# EAGLE design ProMicro_Attniy85_Prog (EAGLE 9.6.2)
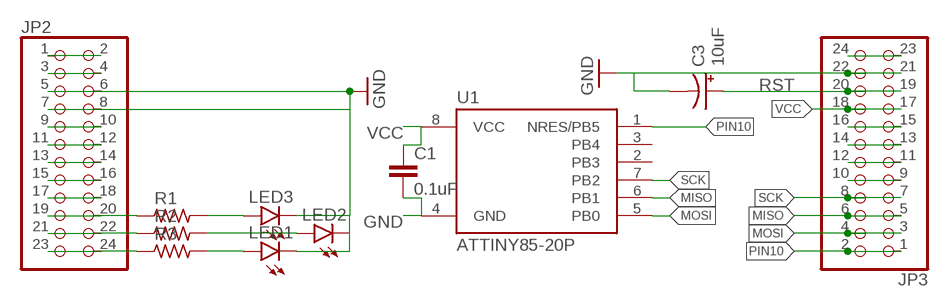
[diagram p0: schematic, sheet 1]

## Parts
C1  0.1uF  0.1UF-0603-100V-10%  [0603]
C3  10uF  10UF-POLAR-EIA3216-16V-10%(TANT)  [EIA3216]
JP2  PINHD-2X12  [2X12]
JP3  PINHD-2X12  [2X12]
LED1  LEDCHIP-LED0805  [CHIP-LED0805]
LED2  LEDCHIP-LED0805  [CHIP-LED0805]
LED3  LEDCHIP-LED0805  [CHIP-LED0805]
R1  R_0805  [R0805]
R2  R_0805  [R0805]
R3  R_0805  [R0805]
U1  ATTINY85-20P  [PDIP08_300MIL]

## Nets
GND [gnd]: C1.2 C3.- JP2.5 JP2.6 JP2.7 JP2.8 JP3.21 JP3.22 LED1.C LED2.C LED3.C U1.4(GND)
MISO: JP3.5 JP3.6 U1.6(PB1)
MOSI: JP3.3 JP3.4 U1.5(PB0)
N$1: JP2.1 JP2.2
N$2: JP2.3 JP2.4
N$3: JP2.9 JP2.10
N$4: JP2.11 JP2.12
N$5: JP2.13 JP2.14
N$6: JP2.15 JP2.16
N$7: JP2.17 JP2.18
N$8: LED3.A R1.2
N$9: LED2.A R2.2
N$10: LED1.A R3.2
N$11: JP3.9 JP3.10
N$12: JP3.11 JP3.12
N$13: JP3.13 JP3.14
N$14: JP3.15 JP3.16
N$15: JP3.23 JP3.24
PIN7: JP2.19 JP2.20 R1.1
PIN8: JP2.21 JP2.22 R2.1
PIN9: JP2.23 JP2.24 R3.1
PIN10: JP3.1 JP3.2 U1.1(NRES/PB5)
RST: C3.+ JP3.19 JP3.20
SCK: JP3.7 JP3.8 U1.7(PB2)
VCC [vcc]: C1.1 JP3.17 JP3.18 U1.8(VCC)
Unconnected: U1.2(PB3) U1.3(PB4)

## Library data of the parts
C1 = SparkFun-Capacitors:0.1UF: 0.1µF ceramic capacitors A capacitor is a passive two-terminal electrical component used to store electrical energy temporarily in an electric field.; PROD_ID: CAP-08390
C3 = SparkFun-Capacitors:10UF-POLAR: 10.0µF polarized capacitors A capacitor is a passive two-terminal electrical component used to store electrical energy temporarily in an electric field.; PROD_ID: CAP-00811
JP2 JP3 = pinhead:PINHD-2X12: PIN HEADER
LED1-LED3 = led:LED: LED OSRAM: - CHIPLED LG R971, LG N971, LY N971, LG Q971, LY Q971, LO R971, LY R971 LH N974, LH R974 LS Q976, LO Q976, LY Q976 LO Q996 - Hyper CHIPLED LW Q18S LB Q993, LB Q99A, LB R99A - SideLED LS A670, LO A670, LY A670, LG A670, LP A670 LB A673, LV A673, LT A673, LW A673 LH A674 LY A675 LS A676, LA A676, LO A676, LY A676, LW A676 LS A679, LY A679, LG A679 - Hyper Micro SIDELED® LS Y876, LA Y876, LO Y876, LY Y876 LT Y87S - SmartLED LW L88C, LW L88S LB L89C, LB L89S, LG L890 LS L89K, LO L89K, LY L89K LS L896, LA L896, LO L896, LY L896 - TOPLED LS T670, LO T670, LY T670, LG T670, LP T670 LSG T670, LSP T670, LSY T670, LOP T670, LYG T670 LG T671, LOG T671, LSG T671 LB T673, LV T673, LT T673, LW T673 LH T674 LS T676, LA T676, LO T676, LY T676, LB T676, LH T676, LSB T676, LW T676 LB T67C, LV T67C, LT T67C, LS T67K, LO T67K, LY T67K, LW E67C LS E67B, LA E67B, LO E67B, LY E67B, LB E67C, LV E67C, LT E67C LW T67C LS T679, LY T679, LG T679 LS T770, LO T770, LY T770, LG T770, LP T770 LB T773, LV T773, LT T773, LW T773 LH T774 LS E675, LA E675, LY E675, LS T675 LS T776, LA T776, LO T776, LY T776, LB T776 LHGB T686 LT T68C, LB T68C - Hyper Mini TOPLED® LB M676 - Mini TOPLED Santana® LG M470 LS M47K, LO M47K, LY M47K Source: http://www.osram.convergy.de LUXEON: - LUMILED® LXK2-PW12-R00, LXK2-PW12-S00, LXK2-PW14-U00, LXK2-PW14-V00 LXK2-PM12-R00, LXK2-PM12-S00, LXK2-PM14-U00 LXK2-PE12-Q00, LXK2-PE12-R00, LXK2-PE12-S00, LXK2-PE14-T00, LXK2-PE14-U00 LXK2-PB12-K00, LXK2-PB12-L00, LXK2-PB12-M00, LXK2-PB14-N00, LXK2-PB14-P00, LXK2-PB14-Q00 LXK2-PR12-L00, LXK2-PR12-M00, LXK2-PR14-Q00, LXK2-PR14-R00 LXK2-PD12-Q00, LXK2-PD12-R00, LXK2-PD12-S00 LXK2-PH12-R00, LXK2-PH12-S00 LXK2-PL12-P00, LXK2-PL12-Q00, LXK2-PL12-R00 Source: www.luxeon.com KINGBRIGHT: KA-3528ASYC Source: www.kingbright.com
R1-R3 = rc-master-smd:R_: RESISTOR
U1 = _hhn_attiny25_45_85 (1):ATTINY85*: ATMEL ATtiny 85 Packages: P = PDIP 08 30mil S = SOIC 08 EIAJ 208mil Technologies Note: for complete ordering code (temp. range, finish, tape&reel etc.) see www.atmel.com • Supply Voltage: V = (1.8…5.5)V | [blank] = (2.7…5.5)V • Speed: 10 = 10 MHz | 20 = 20 MHz Author: Dipl.-Ing. FH Rainer Bayer HHN Hochschule Heilbronn (Heilbronn University), rainer.bayer@hs-heilbronn.de Ingenieurbüro ing-rb, mail@ing-rb.de

## Net classes
0 default: width 0.203 mm
1 vcc: width 0.406 mm
2 gnd: width 0.406 mm

## Board
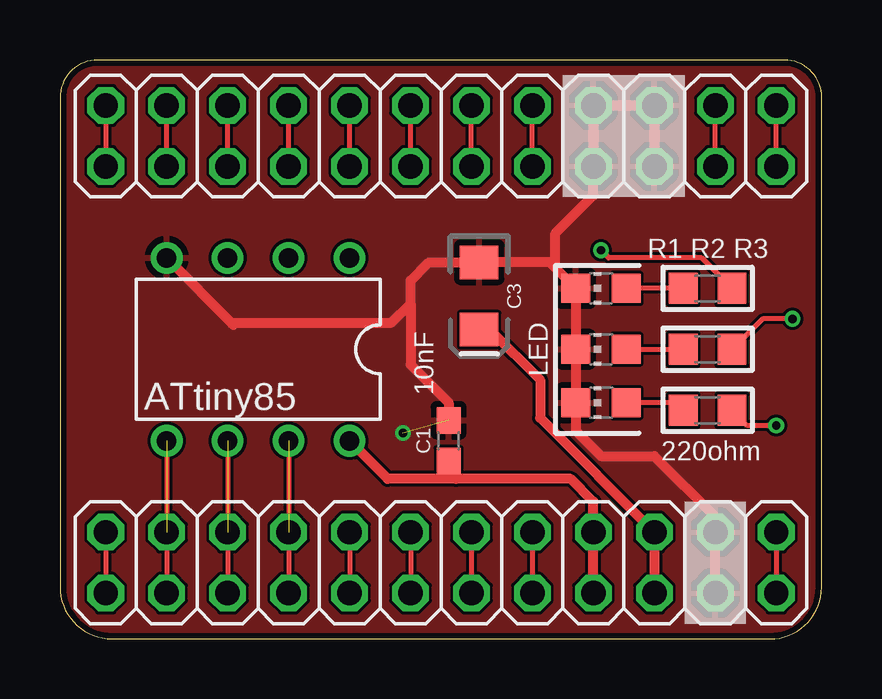
[diagram p1: board, top side]
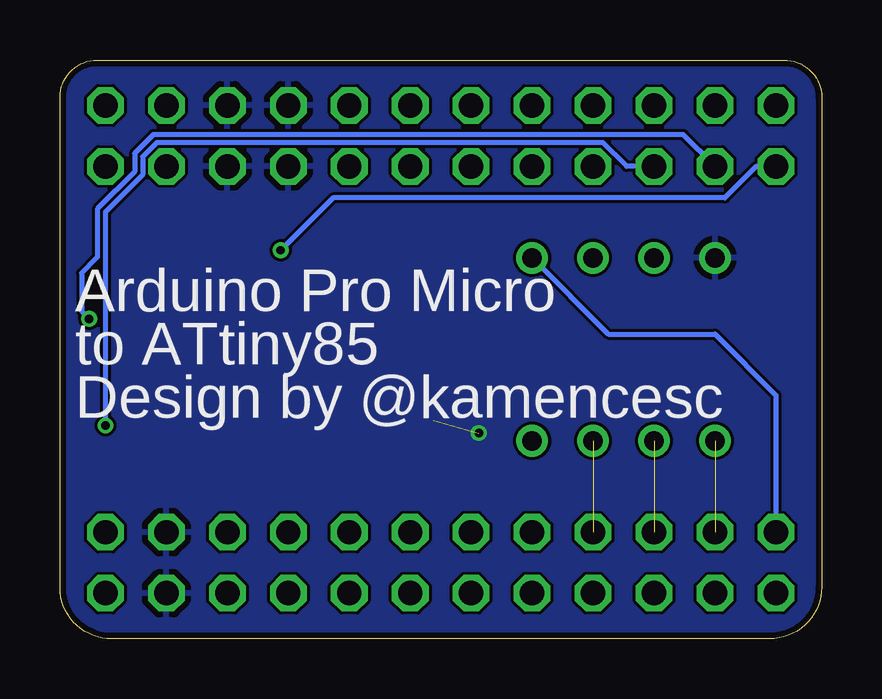
[diagram p2: board, bottom side, seen from below]

Size 31.74 x 24.12 mm. Coordinates in mm from the lower left corner, seen from the top.
Outline: 30.19,24.12 1.57,24.12 arc90 0,22.55 0,2.17 arc90 2.17,0 29.59,0 arc90 31.74,2.15 31.74,22.57 arc90 30.19,24.12
Copper layers (1*16): Top 0.035mm / dielectric 1.5mm / Bottom 0.035mm
Design rules "dirtypcbs_2_layer": minimum track width 5mil, minimum drill 12mil, track to track 5mil, track to pad 5mil, pad to pad 5mil, via to via 5mil, smd to smd 0mil, copper to edge 10mil, drill to drill 10mil, minimum pad ring 10mil, minimum via ring 6mil, stop-mask expansion 2mil, vias tented up to drill 25mil, thermal gap 10mil

### Footprints (pad centres in the part's own frame; a part is rotated, then mirrored left to right if it is on the bottom)
0603 = smd 1.1 x 1: 1 -0.85,0; 2 0.85,0
EIA3216 = smd 1.4 x 1.6: + 1.4,0; - -1.4,0
2X12 = drill 1.016 octagon: 1 -13.97,-1.27; 2 -13.97,1.27; 3 -11.43,-1.27; 4 -11.43,1.27; 5 -8.89,-1.27; 6 -8.89,1.27; 7 -6.35,-1.27; 8 -6.35,1.27; 9 -3.81,-1.27; 10 -3.81,1.27; 11 -1.27,-1.27; 12 -1.27,1.27; 13 1.27,-1.27; 14 1.27,1.27; 15 3.81,-1.27; 16 3.81,1.27; 17 6.35,-1.27; 18 6.35,1.27; 19 8.89,-1.27; 20 8.89,1.27; 21 11.43,-1.27; 22 11.43,1.27; 23 13.97,-1.27; 24 13.97,1.27
CHIP-LED0805 = smd 1.2 x 1.2: A 0,-1.05; C 0,1.05
R0805 = smd 1.2 x 1.3: 1 -1.016,0; 2 1.016,0
PDIP08_300MIL = drill 0.813: 1 -3.81,-3.81; 2 -1.27,-3.81; 3 1.27,-3.81; 4 3.81,-3.81; 5 3.81,3.81; 6 1.27,3.81; 7 -1.27,3.81; 8 -3.81,3.81

### Placement (x,y rotation side)
C1  16.19,8.26 90 top
C3  17.46,14.29 270 top
JP2  15.88,20.95 180 top
JP3  15.88,3.17 0 top
LED1  22.54,14.61 90 top
LED2  22.54,12.06 90 top
LED3  22.54,9.84 90 top
R1  26.99,9.53 180 top
R2  26.99,12.06 180 top
R3  26.99,14.61 180 top
U1  8.26,12.06 180 top

### Tracks (layer width: path | path; a pad name or v marks a point on that pad's centre or on a via)
GND  (via drill 0.35)  (1 unrouted)
  Top 0.406: JP2.6 JP2.5 JP2.7 JP2.8 22.22,18.48 20.64,16.9 20.64,15.46 | U1.4 7.14,13.18 | 7.14,13.18 7.24,13.08 | JP3.21 JP3.22 27.3,5.08 24.76,7.62 22.54,7.62 21.49,8.67 LED3.C LED2.C LED1.C 20.64,15.46 | 14.61,13.97 14.61,14.92 15.37,15.69 C3.- 20.41,15.69 20.64,15.46 | 14.61,13.97 14.61,11.43 16.19,9.84 C1.2 | 7.14,13.18 13.81,13.18 14.61,13.97
  other vias: 14.29,8.57
  pour Top: -0.32,24.45 32.07,24.45 32.07,-0.95 -0.32,-0.95
  pour Bottom: -0.32,24.76 32.39,24.76 32.39,-1.27 -0.32,-1.27
MISO  (2 unrouted)
  Top 0.203: U1.6 JP3.6 JP3.5
MOSI  (2 unrouted)
  Top 0.203: U1.5 JP3.4 JP3.3
N$1
  Top 0.203: JP2.2 JP2.1
N$2
  Top 0.203: JP2.4 JP2.3
N$3
  Top 0.203: JP2.10 JP2.9
N$4
  Top 0.203: JP2.12 JP2.11
N$5
  Top 0.203: JP2.14 JP2.13
N$6
  Top 0.203: JP2.16 JP2.15
N$7
  Top 0.203: JP2.18 JP2.17
N$8
  Top 0.203: R1.2 25.65,9.84 LED3.A
N$9
  Top 0.203: LED2.A R2.2
N$10
  Top 0.203: R3.2 LED1.A
N$11
  Top 0.203: JP3.10 JP3.9
N$12
  Top 0.203: JP3.12 JP3.11
N$13
  Top 0.203: JP3.14 JP3.13
N$14
  Top 0.203: JP3.16 JP3.15
N$15
  Top 0.203: JP3.24 JP3.23
PIN7  (via drill 0.35)
  Top 0.203: JP2.20 JP2.19 | v29.84,8.89 28.64,8.89 R1.1
  Bottom 0.203: JP2.20 8.12,19.68 9.12,20.68 27.71,20.68 28.3,20.09 28.3,19.33 29.84,17.78 v29.84,8.89
PIN8  (via drill 0.35)
  Top 0.203: JP2.22 JP2.21 | v30.52,13.34 29.27,13.34 R2.1
  Bottom 0.203: JP2.22 5.77,21.01 27.85,21.01 28.63,20.23 28.63,19.47 30.17,17.92 30.17,15.9 30.84,15.24 30.84,13.65 v30.52,13.34
PIN9  (via drill 0.35)
  Top 0.203: JP2.23 JP2.24 | R3.1 26.73,15.88 22.86,15.88 v22.54,16.19
  Bottom 0.203: JP2.24 2.73,19.68 4.04,18.38 20.36,18.38 v22.54,16.19
PIN10
  Top 0.203: JP3.2 JP3.1
  Bottom 0.203: U1.1 8.89,12.7 4.45,12.7 1.91,10.16 JP3.2
RST
  Top 0.203: C3.+ 17.91,12.89
  Top 0.406: JP3.19 JP3.20 20,9.21 20,10.79 17.91,12.89
SCK  (2 unrouted)
  Top 0.203: U1.7 JP3.8 JP3.7
VCC
  Top 0.406: U1.8 13.65,6.67 16.51,6.67 | 16.51,6.67 21.27,6.67 22.22,5.71 JP3.18 JP3.17 | 16.51,6.67 16.19,6.99 C1.1

### Text on the board
tPlace: R1 R2 R3 | LED | 10nF | ATtiny85 | 220ohm
bPlace: Arduino Pro Micro | to ATtiny85 | Design by @kamencesc